# Altium schematic sheet PowerCircuit.SchDoc
size A; SheetNumber: 2; SheetTotal: 8
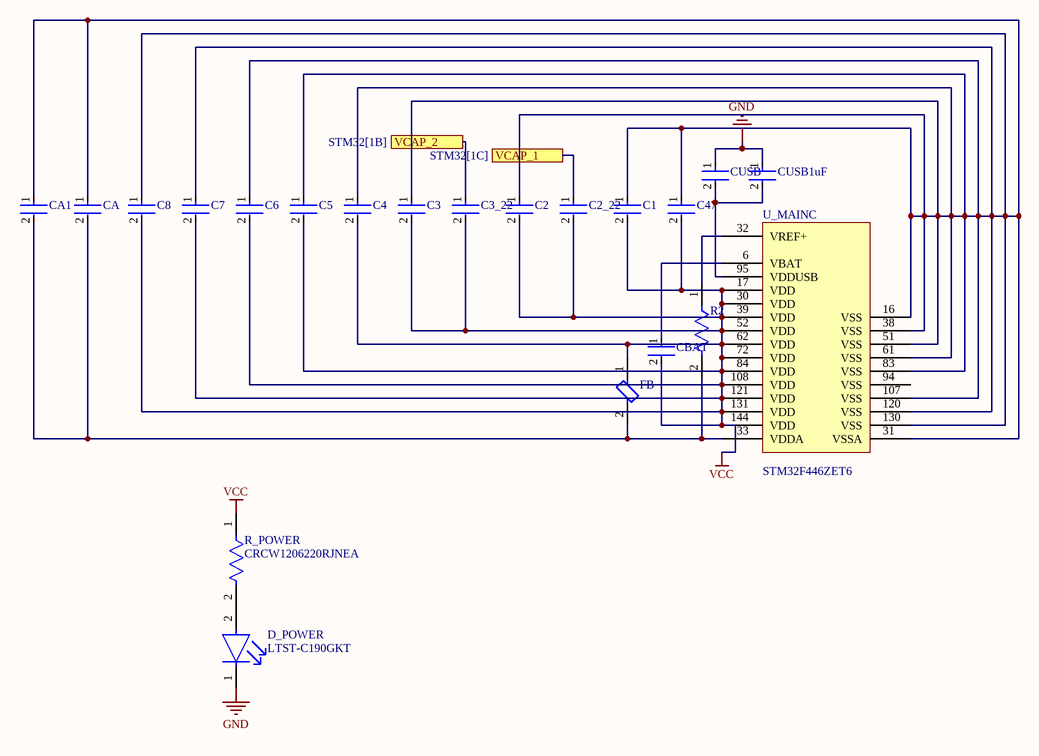
[diagram p0: PowerCircuit.SchDoc]

## Parts
C1  GCM155L81E104KE02D  [FP-GCM155-0_05-IPC_B]  (value not drawn)
C2  GCM155L81E104KE02D  [FP-GCM155-0_05-IPC_B]  (value not drawn)
C2_22  GRM155R61E225ME15D  [FP-GRM155-0_2-0_05-MFG]  (value not drawn)
C3  GCM155L81E104KE02D  [FP-GCM155-0_05-IPC_B]  (value not drawn)
C3_22  GRM155R61E225ME15D  [FP-GRM155-0_2-0_05-MFG]  (value not drawn)
C4  GCM155L81E104KE02D  [FP-GCM155-0_05-IPC_B]  (value not drawn)
C5  GCM155L81E104KE02D  [FP-GCM155-0_05-IPC_B]  (value not drawn)
C6  GCM155L81E104KE02D  [FP-GCM155-0_05-IPC_B]  (value not drawn)
C7  GCM155L81E104KE02D  [FP-GCM155-0_05-IPC_B]  (value not drawn)
C8  GCM155L81E104KE02D  [FP-GCM155-0_05-IPC_B]  (value not drawn)
C47  GRM188R61C475KE11D  [FP-GRM188-0_15-MFG]  (value not drawn)
CA  GCM155L81E104KE02D  [FP-GCM155-0_05-IPC_B]  (value not drawn)
CA1  GRM155R61C105KA12D  [FP-GRM155-0_05-IPC_C]  (value not drawn)
CBAT  GCM155L81E104KE02D  [FP-GCM155-0_05-IPC_B]  (value not drawn)
CUSB  GCM155L81E104KE02D  [FP-GCM155-0_05-IPC_B]  (value not drawn)
CUSB1uF  GCM155L81E104KE02D  [FP-GCM155-0_05-IPC_B]  (value not drawn)
D_POWER  LTST-C190GKT  [FP-LTST-C190GKT-MFG]
FB  BLM15AX601SN1D  [FP-BLM15-0_05-IPC_B]  (value not drawn)
R2  RMCF0201ZT0R00  [FP-RMCF0201-IPC_C]  (value not drawn)
R_POWER  CRCW1206220RJNEA  [FP-CRCW1206-e3-IPC_C]
U_MAIN  STM32F446ZET6  [STM-LQFP144_M]  (part C of 3)

## Ports
VCAP_1 (see STM32[1C]), VCAP_2 (see STM32[1B])

## Nets
GND: CUSB.1 CUSB1uF.1 D_POWER.1(C)
VCC: C1.2 C2.2 C2_22.2 C3.2 C3_22.2 C4.2 C5.2 C6.2 C7.2 C8.2 C47.2 CBAT.2 FB.1 R_POWER.1 U_MAIN.17(VDD) U_MAIN.30(VDD) U_MAIN.39(VDD) U_MAIN.52(VDD) U_MAIN.62(VDD) U_MAIN.72(VDD) U_MAIN.84(VDD) U_MAIN.108(VDD) U_MAIN.121(VDD) U_MAIN.131(VDD) U_MAIN.144(VDD)
VCAP_1: C2_22.1 ; port VCAP_1
VCAP_2: C3_22.1 ; port VCAP_2
NetC1_1: C1.1 C2.1 C3.1 C4.1 C5.1 C6.1 C7.1 C8.1 C47.1 CA.1 CA1.1 U_MAIN.16(VSS) U_MAIN.31(VSSA) U_MAIN.38(VSS) U_MAIN.51(VSS) U_MAIN.61(VSS) U_MAIN.83(VSS) U_MAIN.107(VSS) U_MAIN.120(VSS) U_MAIN.130(VSS)
NetCA_2: CA.2 CA1.2 FB.2 R2.2 U_MAIN.33(VDDA)
NetCBAT_1: CBAT.1 U_MAIN.6(VBAT)
NetCUSB_2: CUSB.2 CUSB1uF.2 U_MAIN.95(VDDUSB)
NetD_POWER_2: D_POWER.2(A) R_POWER.2
NetR2_1: R2.1 U_MAIN.32(VREF+)

Not connected (* = marked no-connect by the designer): U_MAIN 94(VSS)

## Library data of the parts
C1-C8 CA CBAT CUSB CUSB1uF = CMP-06035-044163-1: Ceramic Capacitor for Automotive 100nF ±10% 25VDC X8L 0402 Paper T/R
C2_22 C3_22 = CMP-06035-061317-1: Chip Multilayer Ceramic Capacitors for General Purpose, 0402, 2.2uF, X5R, 15%, 20%, 25V; Length: 0.039inch; Width: 0.02inch; Case Code (Imperial): 0402; Package Quantity: 10000; Voltage Rating: 25V; Mount: Surface Mount; Height: 0.5mm; Voltage Rating (DC): 25V; Capacitance: 2.2uF; Thickness: 0.022inch; Termination: SMD/SMT; Max Operating Temperature: 85°C; Dielectric: X5R; Tolerance: 20%; Case/Package: 0402; Case Code (Metric): 1005; Weight: 0.000212oz; Packaging: Tape and Reel; Min Operating Temperature: -55°C
C47 = CMP-06035-007733-2: Chip Multilayer Ceramic Capacitors for General Purpose, 0603, 4.7uF, X5R, 15%, 10%, 16V; Min Operating Temperature: -55°C; Case Code (Imperial): 0603; Height: 0.8mm; Series: GRM; Voltage Rating (DC): 16V; Case Code (Metric): 1608; Package Quantity: 4000; Tolerance: 10%; Capacitance: 4.7uF; Mount: Surface Mount; Termination: SMD/SMT; Resistor Type: Ceramic; Lead Free: Lead Free; Voltage Rating: 16V; RoHS Compliant: Yes; Case/Package: 0603; Max Operating Temperature: 85°C; Length: 0.063inch; Weight: 0.000222oz; Packaging: Tape and Reel; Thickness: 0.037inch; Width: 0.031inch; Dielectric: X5R
CA1 = CMP-2008-04573-2: Chip Multilayer Ceramic Capacitors for General Purpose, 0402, 1.0uF, X5R, 15%, 10%, 16V; Capacitance: 1uF; Case Code (Imperial): 0402; Max Operating Temperature: 85°C; Mount: Surface Mount; Voltage Rating (DC): 16V; Material: Ceramic; Depth: 0.5mm; Voltage: 16V; Height: 0.5mm; Dielectric: X5R; Thickness: 0.022inch; Lead Free: Lead Free; Min Operating Temperature: -55°C; Packaging: Tape and Reel; Radiation Hardening: No; Case/Package: 0402; Width: 0.02inch; Length: 1mm; REACH SVHC: No SVHC; Case Code (Metric): 1005; Voltage Rating: 16V; Tolerance: 10%
D_POWER = CMP-22017-000005-2: LED GREEN CLEAR CHIP SMD; Dominant Wavelength: 569nm; Reverse Voltage: 5V; Lens Color: Colorless; Viewing Angle: 130°; Voltage: 2V; Forward Current: 30mA; Power Dissipation: 100mW; Luminous Intensity: 6mcd; Number of LEDs: 1; Forward Voltage: 2.1V; Wavelength: 565nm; Test Current: 10mA; Min Operating Temperature: -55°C; Lens Style: Clear; Mount: Surface Mount; Width: 0.8mm; Packaging: Tape and Reel; Lens Transparency: Clear; Case Code (Metric): 1608; Depth: 0.8mm; Case Code (Imperial): 0603; Case/Package: 0603; Number of Pins: 2; Max Operating Temperature: 85°C; Lead Free: Lead Free; Number of Elements: 1; Length: 1.6mm; Height: 0.8mm; Package Quantity: 1; Power Rating: 100mW; Radiation Hardening: No; Illumination Color: Green; Color: Green
FB = CMP-0686-00246-4: Chip Ferrite Bead, 0402, 600Ω @ 100MHz, 0.34Ω, 25%, 500mA; DC Resistance (DCR): 340mR; Impedance: 600R; Number of Circuits: 1; Max Current Rating: 500mA; Material: Steel; Core Material: Ferrite; Lead Free: Lead Free; Series: BLM15AX_SN; Number of Pins: 2; Package Quantity: 1; Length: 1mm; Height: 0.5mm; Width: 0.5mm; Packaging: Tape and Reel; RoHS Compliant: Yes; Test Frequency: 100MHz; Case Code (Imperial): 0402; Depth: 0.5mm; Case/Package: 0402; Min Operating Temperature: -55°C; Max Operating Temperature: 125°C; Max DC Current: 500mA; Current Rating: 500mA; REACH SVHC: No SVHC; Termination: SMD/SMT; Tolerance: 25%; Case Code (Metric): 1005; Number of Lines: 1; DC Resistance-Max: 340mR
R2 = CMP-26527-001890-1: 0Ω ±0 0.05W 0201 Thick Film Chip Resistor AEC-Q200 compliant; Max Power Dissipation: 50mW; Resistance: 0R; Packaging: Tape and Reel; Case/Package: 0201; Lead Free: Lead Free; Mount: Surface Mount; Series: RMCF; Power Rating: 50mW; Max Operating Temperature: 125°C; Resistor Type: Thick Film; Height - Seated (Max): 0.01inch; Package Quantity: 10000; RoHS Compliant: Yes; Case Code (Metric): 0603; Height: 0.009inch; Radiation Hardening: No; Case Code (Imperial): 0201; Number of Terminations: 2; Contact Plating: Tin; Width: 0.012inch; Min Operating Temperature: -55°C; Length: 0.024inch
R_POWER = CMP-1014-00058-3: RES Thick Film, 220Ω, 5%, 0.25W, 200ppm/°C, 1206; Voltage Rating: 200V; Max Power Dissipation: 250mW; Resistance: 220R; Length: 3.2mm; Weight: 0.000353oz; Termination: SMD/SMT; Min Operating Temperature: -55°C; Height: 0.55mm; Temperature Coefficient: 200ppm/°C; Case Code (Imperial): 1206; Max Operating Temperature: 155°C; Depth: 1.6mm; Width: 0.063inch; Lead Free: Lead Free; Tolerance: 5%; Composition: Thick Film; Case Code (Metric): 3216; Features: Automotive AEC-Q200; Number of Terminations: 2; Voltage Rating (DC): 200V; Packaging: Tape and Reel; Case/Package: 1206; Military Standard: Not; Radiation Hardening: No; Contact Plating: Tin; Package Quantity: 5000; Power Rating: 250mW
U_MAIN = CMP-0243-00226-1: ARM Cortex-M4 32-bit MCU+FPU, 512 KB Flash, 128 KB Internal RAM, 114 I/Os, 144-Pin LQFP, -40 to 85 degC, Tray; Operating Frequency(F) (Processor speed) (MHz): 180; Internal RAM Size (kB): 128; FLASH Size (Prog) (kB): 512; I/Os (High Current): 114; D/A Converter: 2; Supply Voltage(Vcc) min (V): 1.7; DatasheetVersion: Rev. 6; Package Reference: 144-Pin Low Profile Quad Flat Package, Body 20 x 20 mm, Pitch 0.5 mm; Package Description: LQFP144; ComponentLink2Description: Datasheet; ComponentLink2URL: http://www.st.com/st-web-ui/static/active/en/resource/technical/document/datasheet/DM00141306.pdf; Mounting Technology: Surface Mount; ComponentLink1Description: Manufacturer URL; Core: ARM Cortex-M4; ComponentLink1URL: http://www.st.com/; Packing: Tray